# Altium schematic sheet 00_SYSTEM_TOP.SchDoc
size A; SheetNumber: 1; SheetTotal: 8
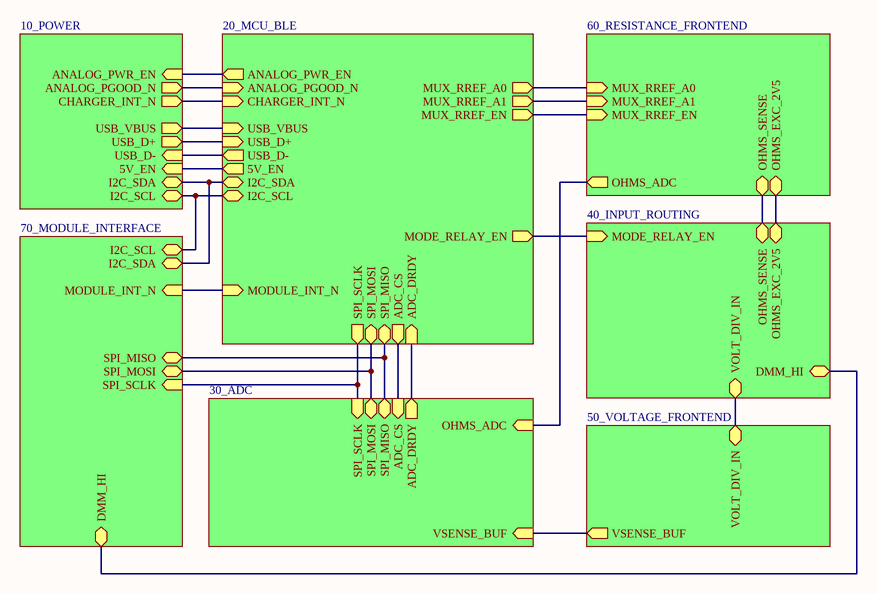
[diagram p0: 00_SYSTEM_TOP.SchDoc]

## Sub-sheets
10_POWER = 10_POWER.SchDoc: I2C_SCL (bidir), I2C_SDA (bidir), 5V_EN (in), USB_D- (in), USB_D+ (out), USB_VBUS (out), CHARGER_INT_N (out), ANALOG_PGOOD_N (out), ANALOG_PWR_EN (in)
20_MCU_BLE = 20_MCU_BLE.SchDoc: MUX_RREF_EN (out), MUX_RREF_A1 (out), MUX_RREF_A0 (out), USB_D+ (in), I2C_SDA (bidir), I2C_SCL (bidir), 5V_EN (out), USB_D- (out), USB_VBUS (in), ANALOG_PWR_EN (out), ANALOG_PGOOD_N (in), CHARGER_INT_N (in), ADC_DRDY (in), ADC_CS (out), SPI_MISO (bidir), SPI_MOSI (bidir), SPI_SCLK (out), MODULE_INT_N (in), MODE_RELAY_EN (out)
30_ADC = 30_ADC.SchDoc: VSENSE_BUF (in), OHMS_ADC (in), ADC_DRDY (out), ADC_CS (in), SPI_MISO (bidir), SPI_MOSI (bidir), SPI_SCLK (in)
40_INPUT_ROUTING = 40_INPUT_ROUTING.SchDoc: OHMS_EXC_2V5 (bidir), OHMS_SENSE (bidir), MODE_RELAY_EN (in), DMM_HI (bidir), VOLT_DIV_IN (bidir)
50_VOLTAGE_FRONTEND = 50_VOLTAGE_FRONTEND.SchDoc: VSENSE_BUF (out), VOLT_DIV_IN (bidir)
60_RESISTANCE_FRONTEND = 60_RESISTANCE_FRONTEND.SchDoc: MUX_RREF_A0 (in), MUX_RREF_A1 (in), MUX_RREF_EN (in), OHMS_EXC_2V5 (bidir), OHMS_SENSE (bidir), OHMS_ADC (out)
70_MODULE_INTERFACE = 70_MODULE_INTERFACE.SchDoc: SPI_SCLK (in), SPI_MOSI (bidir), SPI_MISO (bidir), MODULE_INT_N (in), I2C_SCL (bidir), I2C_SDA (bidir), DMM_HI (bidir)

## Nets
(unnamed): sheet 10_POWER/I2C_SCL, sheet 70_MODULE_INTERFACE/I2C_SCL, sheet 20_MCU_BLE/I2C_SCL
(unnamed): sheet 10_POWER/I2C_SDA, sheet 70_MODULE_INTERFACE/I2C_SDA, sheet 20_MCU_BLE/I2C_SDA
(unnamed): sheet 10_POWER/5V_EN, sheet 20_MCU_BLE/5V_EN
(unnamed): sheet 10_POWER/USB_D-, sheet 20_MCU_BLE/USB_D-
(unnamed): sheet 10_POWER/USB_D+, sheet 20_MCU_BLE/USB_D+
(unnamed): sheet 10_POWER/USB_VBUS, sheet 20_MCU_BLE/USB_VBUS
(unnamed): sheet 10_POWER/CHARGER_INT_N, sheet 20_MCU_BLE/CHARGER_INT_N
(unnamed): sheet 10_POWER/ANALOG_PGOOD_N, sheet 20_MCU_BLE/ANALOG_PGOOD_N
(unnamed): sheet 10_POWER/ANALOG_PWR_EN, sheet 20_MCU_BLE/ANALOG_PWR_EN
(unnamed): sheet 70_MODULE_INTERFACE/SPI_SCLK, sheet 20_MCU_BLE/SPI_SCLK, sheet 30_ADC/SPI_SCLK
(unnamed): sheet 70_MODULE_INTERFACE/SPI_MOSI, sheet 20_MCU_BLE/SPI_MOSI, sheet 30_ADC/SPI_MOSI
(unnamed): sheet 70_MODULE_INTERFACE/SPI_MISO, sheet 20_MCU_BLE/SPI_MISO, sheet 30_ADC/SPI_MISO
(unnamed): sheet 70_MODULE_INTERFACE/MODULE_INT_N, sheet 20_MCU_BLE/MODULE_INT_N
(unnamed): sheet 70_MODULE_INTERFACE/DMM_HI, sheet 40_INPUT_ROUTING/DMM_HI
(unnamed): sheet 20_MCU_BLE/MUX_RREF_EN, sheet 60_RESISTANCE_FRONTEND/MUX_RREF_EN
(unnamed): sheet 20_MCU_BLE/MUX_RREF_A1, sheet 60_RESISTANCE_FRONTEND/MUX_RREF_A1
(unnamed): sheet 20_MCU_BLE/MUX_RREF_A0, sheet 60_RESISTANCE_FRONTEND/MUX_RREF_A0
(unnamed): sheet 20_MCU_BLE/ADC_DRDY, sheet 30_ADC/ADC_DRDY
(unnamed): sheet 20_MCU_BLE/ADC_CS, sheet 30_ADC/ADC_CS
(unnamed): sheet 20_MCU_BLE/MODE_RELAY_EN, sheet 40_INPUT_ROUTING/MODE_RELAY_EN
(unnamed): sheet 40_INPUT_ROUTING/OHMS_EXC_2V5, sheet 60_RESISTANCE_FRONTEND/OHMS_EXC_2V5
(unnamed): sheet 40_INPUT_ROUTING/OHMS_SENSE, sheet 60_RESISTANCE_FRONTEND/OHMS_SENSE
(unnamed): sheet 40_INPUT_ROUTING/VOLT_DIV_IN, sheet 50_VOLTAGE_FRONTEND/VOLT_DIV_IN
(unnamed): sheet 50_VOLTAGE_FRONTEND/VSENSE_BUF, sheet 30_ADC/VSENSE_BUF
(unnamed): sheet 60_RESISTANCE_FRONTEND/OHMS_ADC, sheet 30_ADC/OHMS_ADC